# EAGLE design lyme_shield_system_gen2 (EAGLE 9.6.2)
APPROVED: MK; CONTACT: rluttrell@hatchpoint.com; DESIGNED: RSL; FILENAME: lyme_shield_system.sch; REV: 1.1; SCHEMATIC_TITLE: LymeShieldSystem Main Board; SIZE: A1
Assembly variants: A

## Sheet 1 of 3: Title Page and Revisions
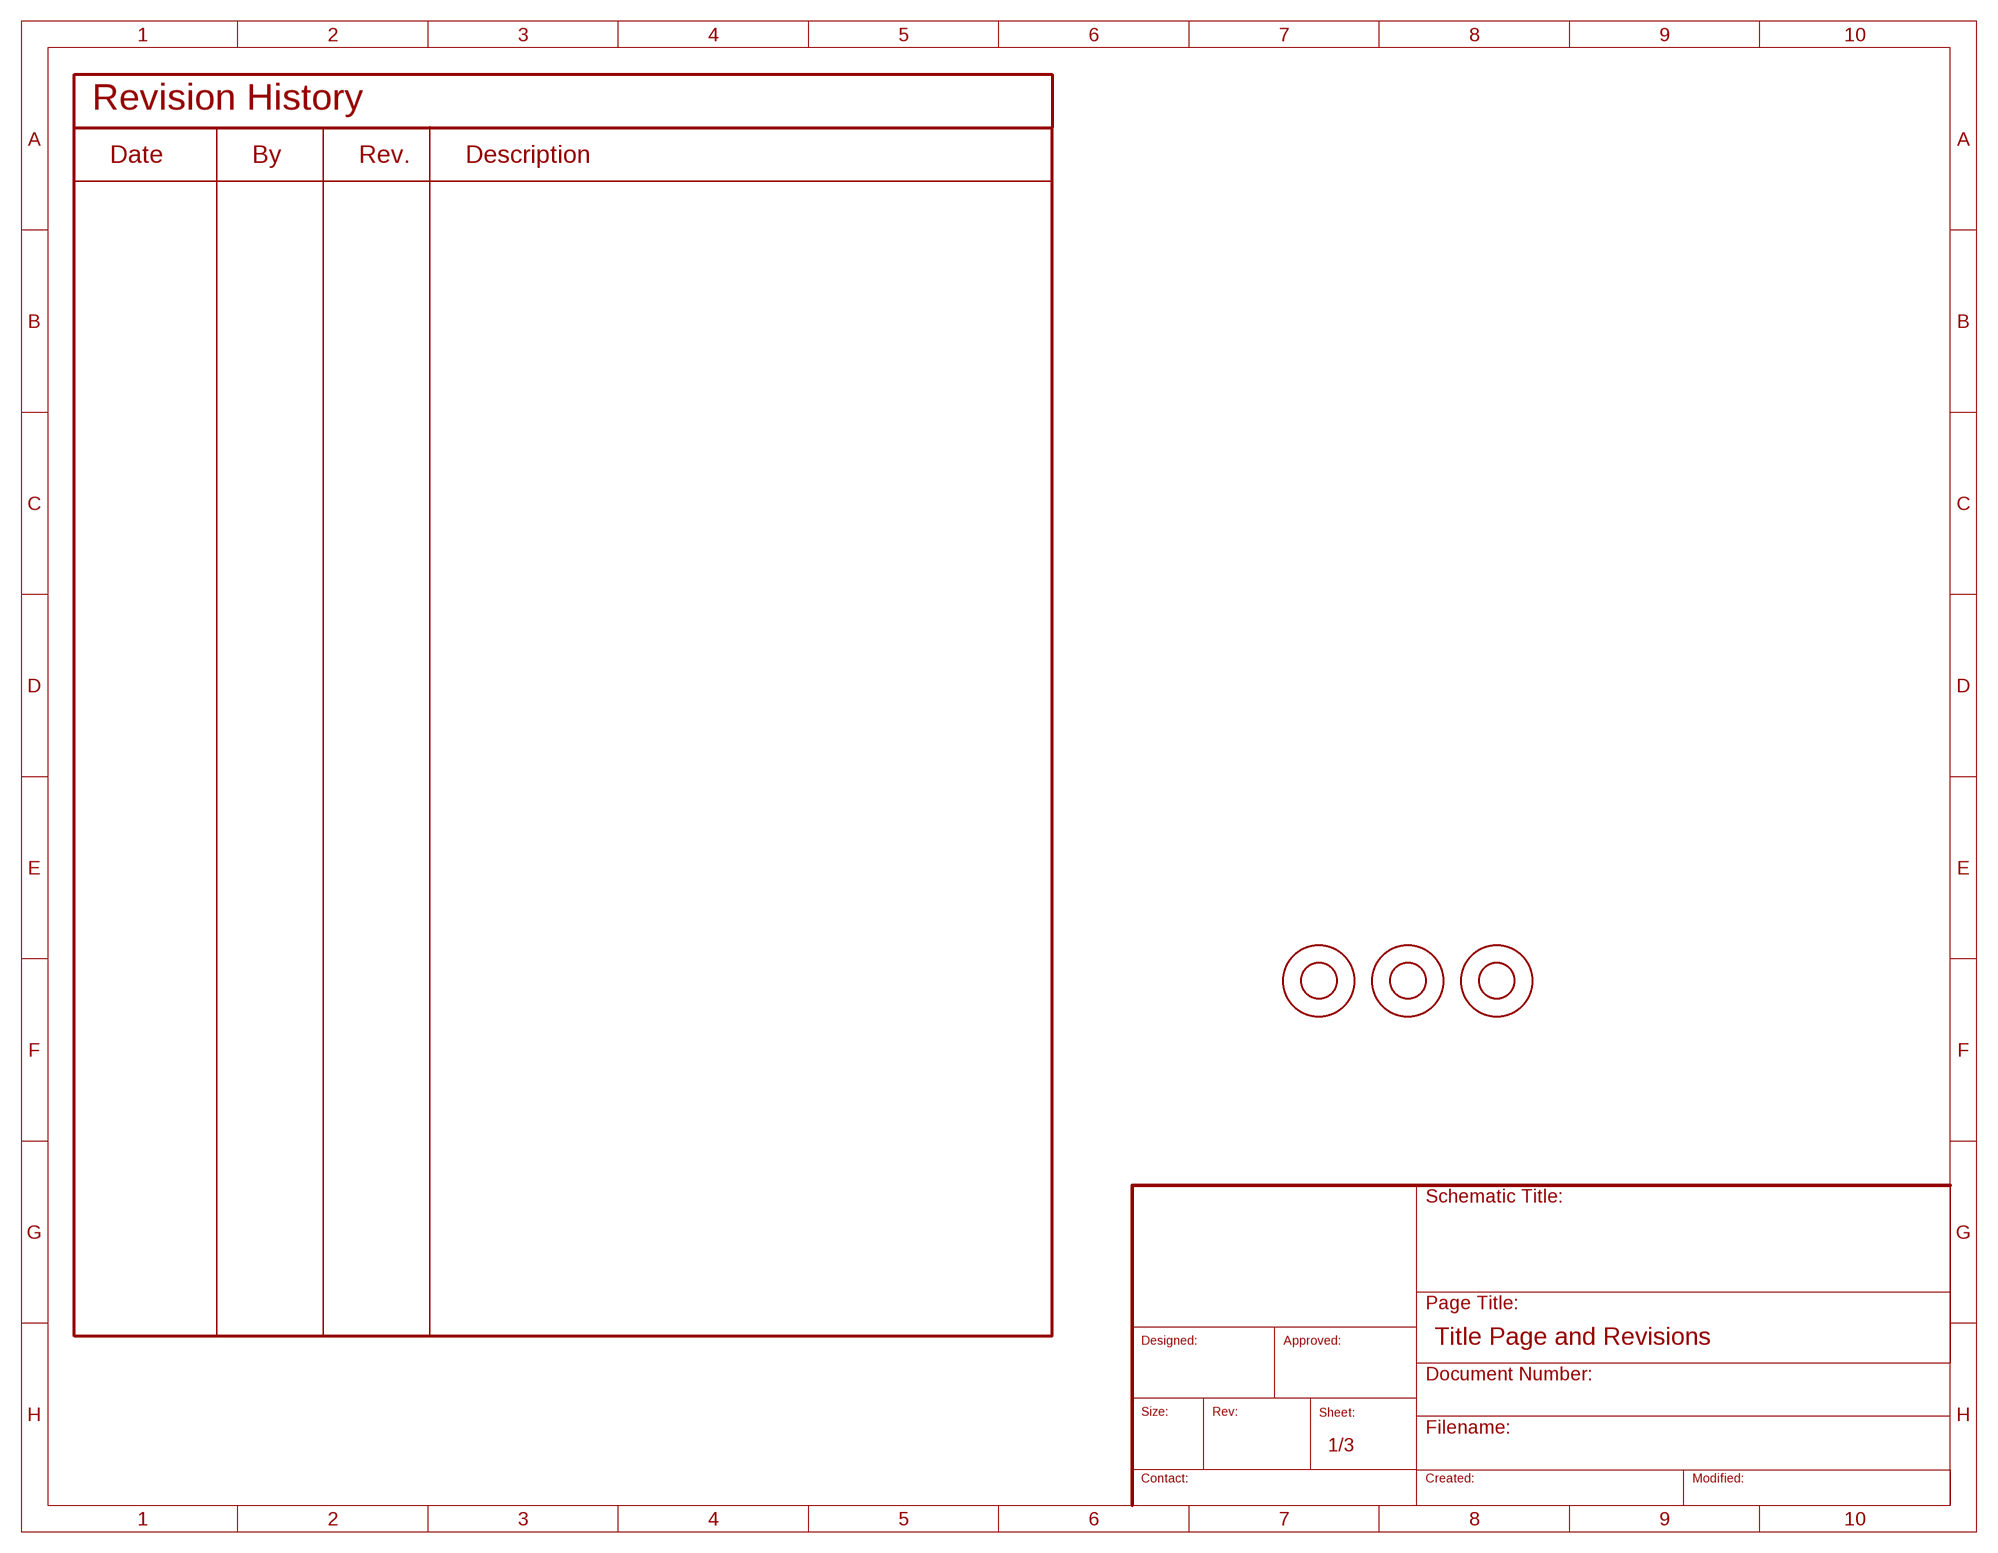
[diagram p0: schematic, sheet 1]

### Parts
FID1  FIDUCIAL_1MM_TOP_BOTTOM  [FIDUCIAL_1MM_TOP_BOTTOM]  (not fitted in variant A)
FID2  FIDUCIAL_1MM_TOP_BOTTOM  [FIDUCIAL_1MM_TOP_BOTTOM]  (not fitted in variant A)
FID3  FIDUCIAL_1MM_TOP_BOTTOM  [FIDUCIAL_1MM_TOP_BOTTOM]  (not fitted in variant A)

## Sheet 2 of 3: Microcontroller and Peripherals
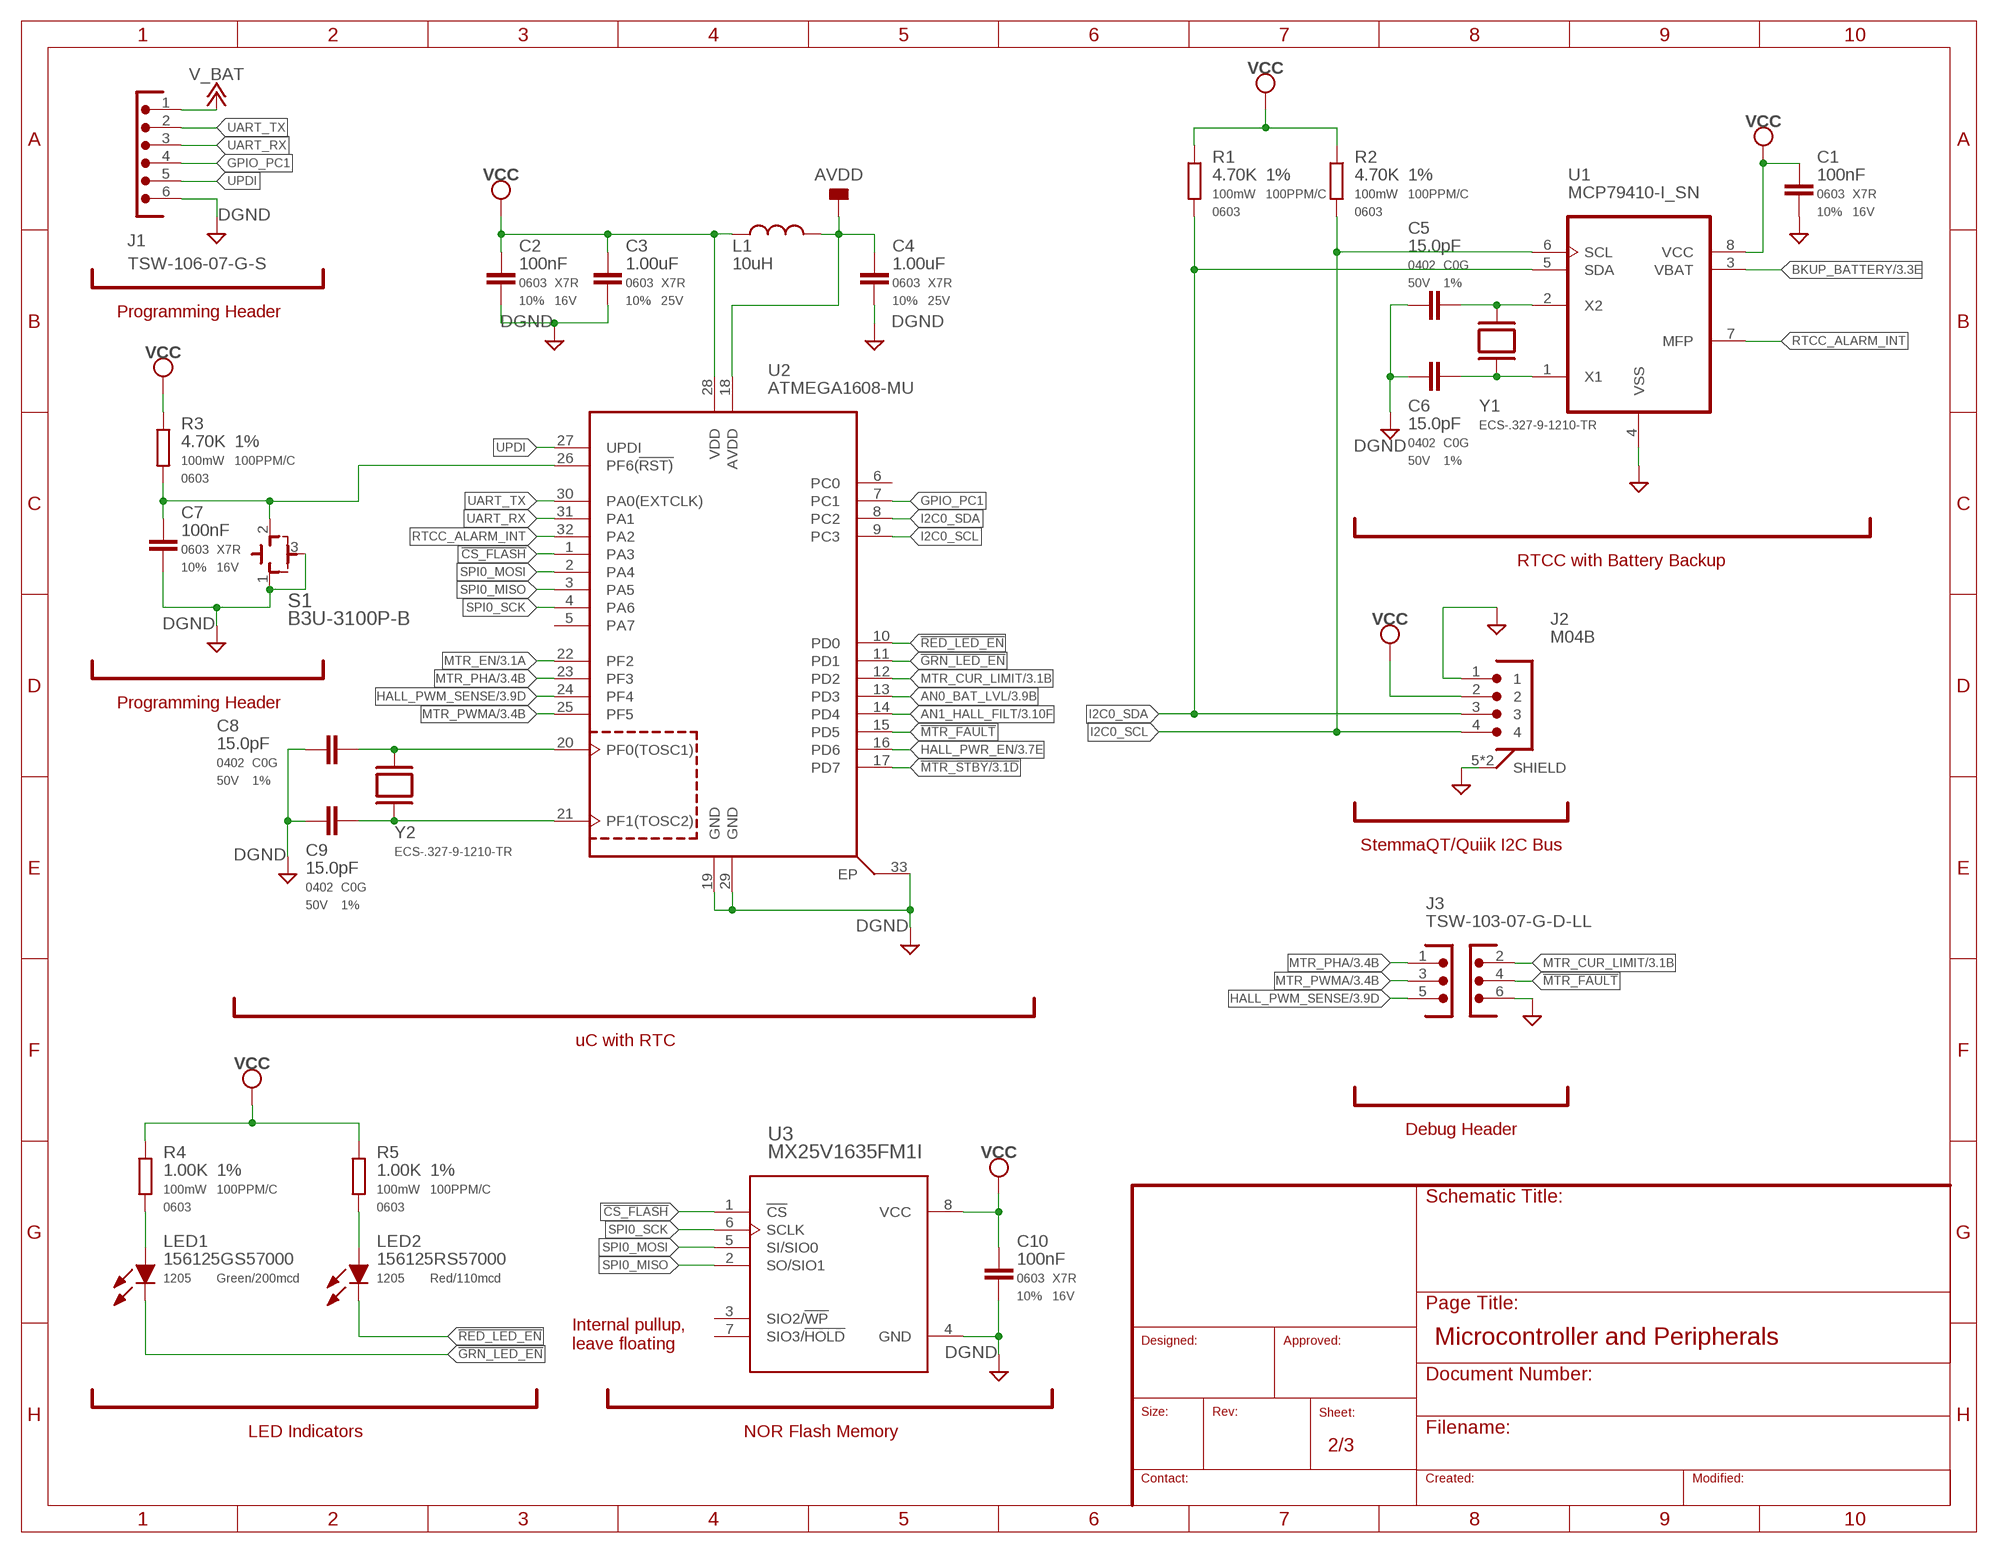
[diagram p1: schematic, sheet 2]

### Parts
C1  100nF  GCM188R71C104KA37J  [CAPC_0603_1608X90N]  (not fitted in variant A)
C2  100nF  GCM188R71C104KA37J  [CAPC_0603_1608X90N]
C3  1.00uF  GCM188R71E105KA64D  [CAPC_0603_1608X90N]
C4  1.00uF  GCM188R71E105KA64D  [CAPC_0603_1608X90N]
C5  15.0pF  GCM1555C1H150FA16D  [CAPC_0402_1005X55N]  (not fitted in variant A)
C6  15.0pF  GCM1555C1H150FA16D  [CAPC_0402_1005X55N]  (not fitted in variant A)
C7  100nF  GCM188R71C104KA37J  [CAPC_0603_1608X90N]
C8  15.0pF  GCM1555C1H150FA16D  [CAPC_0402_1005X55N]
C9  15.0pF  GCM1555C1H150FA16D  [CAPC_0402_1005X55N]
C10  100nF  GCM188R71C104KA37J  [CAPC_0603_1608X90N]  (not fitted in variant A)
J1  TSW-106-07-G-S  [HDR-100MIL-1X6-THRU]  (not fitted in variant A)
J2  M04B  [SM04B-SRSS-TB(LFSN)]  (not fitted in variant A)
J3  TSW-103-07-G-D-LL  [HDRV6W64P254_2X3_762X495X838P]  (not fitted in variant A)
L1  10uH  LB1608T100M  [INDC1608X90N]
LED1  156125GS57000  [LEDC3212X120N]
LED2  156125RS57000  [LEDC3212X120N]
R1  4.70K  CRCW06034K70FKEA  [R0603K]
R2  4.70K  CRCW06034K70FKEA  [R0603K]
R3  4.70K  CRCW06034K70FKEA  [R0603K]
R4  1.00K  CRCW06031K00FKEAC  [R0603K]
R5  1.00K  CRCW06031K00FKEAC  [R0603K]
S1  B3U-3100P-B  [B3U-3100P-B]
U1  MCP79410-I_SN  [SOIC127P600X175-8N]  (not fitted in variant A)
U2  ATMEGA1608-MU  [QFN50P500X500X90-33N]
U3  MX25V1635FM1I  [SOIC127P600X175-8N]  (not fitted in variant A)
Y1  ECS-.327-9-1210-TR  [XTAL_ECS-.327-9-1210-TR]  (not fitted in variant A)
Y2  ECS-.327-9-1210-TR  [XTAL_ECS-.327-9-1210-TR]

### Nets
!CS_FLASH: U2.1(PA3) U3.1(!CS)
!GRN_LED_EN: LED1.1(K) U2.11(PD1)
!MTR_FAULT: J3.4 U2.15(PD5)
!MTR_STBY: U2.17(PD7) ; also sheet 3
!RED_LED_EN: LED2.1(K) U2.10(PD0)
!RST: C7.1 R3.2 S1.2(NO) U2.26(PF6(!RST))
AN0_BAT_LVL: U2.13(PD3) ; also sheet 3
AN1_HALL_FILT: U2.14(PD4) ; also sheet 3
AVDD: C4.1 L1.2 U2.18(AVDD)
BKUP_BATTERY: U1.3(VBAT) ; also sheet 3
DGND [pwr]: C1.2 C2.2 C3.2 C4.2 C5.2 C6.2 C7.2 C8.2 C9.2 C10.2 J1.6 J2.1 J2.5(SHIELD) J2.6(SHIELD) J3.6 S1.1(COM) S1.3(COM1) U1.4(VSS) U2.19(GND) U2.29(GND) U2.33(EP) U3.4(GND) ; also sheet 3
GPIO_PC1: J1.4 U2.7(PC1)
HALL_PWM_SENSE: J3.5 U2.24(PF4) ; also sheet 3
HALL_PWR_EN: U2.16(PD6) ; also sheet 3
I2C0_SCL: J2.4 R2.2 U1.6(SCL) U2.9(PC3)
I2C0_SDA: J2.3 R1.2 U1.5(SDA) U2.8(PC2)
MTR_CUR_LIMIT: J3.2 U2.12(PD2) ; also sheet 3
MTR_EN: U2.22(PF2) ; also sheet 3
MTR_PHA: J3.1 U2.23(PF3) ; also sheet 3
MTR_PWMA: J3.3 U2.25(PF5) ; also sheet 3
N$1: C8.1 U2.20(PF0(TOSC1)) Y2.1
N$2: C5.1 U1.2(X2) Y1.1
N$8: LED1.2(A) R4.2
N$9: LED2.2(A) R5.2
N$16: C9.1 U2.21(PF1(TOSC2)) Y2.2
N$17: C6.1 U1.1(X1) Y1.2
RTCC_ALARM_INT: U1.7(MFP) U2.32(PA2)
SPI0_MISO: U2.3(PA5) U3.2(SO/SIO1)
SPI0_MOSI: U2.2(PA4) U3.5(SI/SIO0)
SPI0_SCK: U2.4(PA6) U3.6(SCLK)
UART_RX: J1.3 U2.31(PA1)
UART_TX: J1.2 U2.30(PA0(EXTCLK))
UPDI: J1.5 U2.27(UPDI)
V_BAT [high_current]: J1.1 ; also sheet 3
VCC [pwr]: C1.1 C2.1 C3.1 C10.1 J2.2 L1.1 R1.1 R2.1 R3.1 R4.1 R5.1 U1.8(VCC) U2.28(VDD) U3.8(VCC) ; also sheet 3
Unconnected: U2.5(PA7) U2.6(PC0) U3.3(SIO2/!WP) U3.7(SIO3/!HOLD)

### Notes on the sheet
- Programming Header
- RTCC with Battery Backup
- Programming Header
- StemmaQT/Quiik I2C Bus
- uC with RTC
- Debug Header
- Internal pullup, 
  leave floating
- LED Indicators | NOR Flash Memory

## Sheet 3 of 3: Motor Driver and Position Sensor
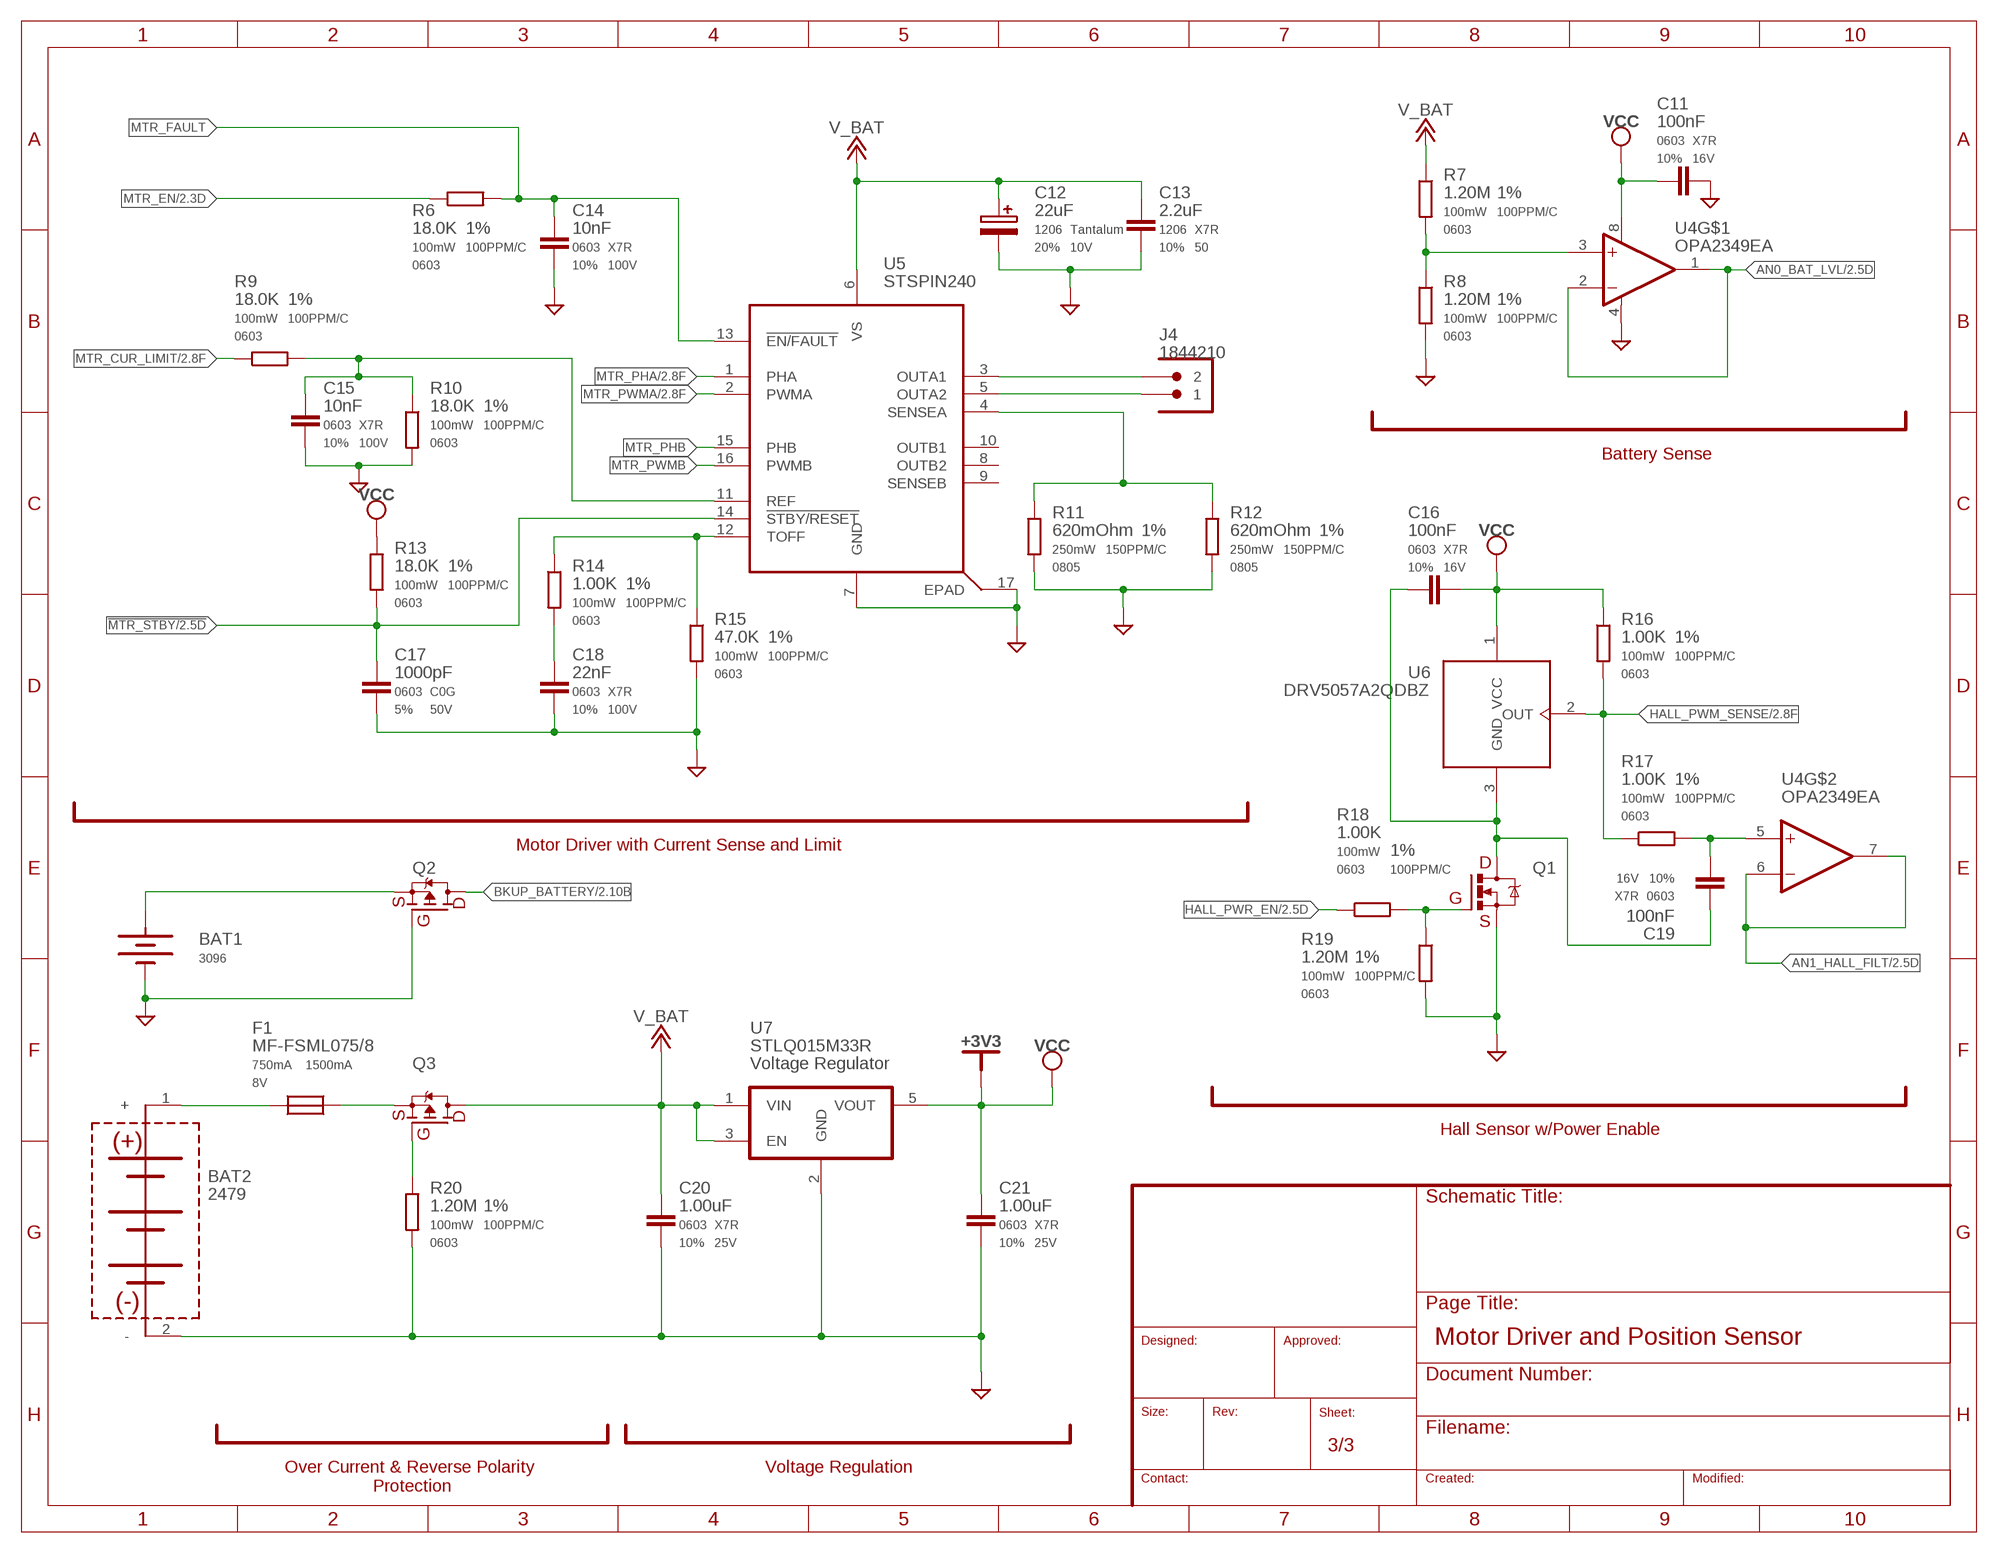
[diagram p2: schematic, sheet 3]

### Parts
BAT1  3096  [3096]  (not fitted in variant A)
BAT2  2479  [2479]
C11  100nF  GCM188R71C104KA37J  [CAPC_0603_1608X90N]
C12  22uF  TAJC226M010RNJ  [CAPC_1206]
C13  2.2uF  GCM31CR71H225KA55L  [CAPC_1206]
C14  10nF  GCM188R72A103KA37D  [CAPC_0603_1608X90N]
C15  10nF  GCM188R72A103KA37D  [CAPC_0603_1608X90N]
C16  100nF  GCM188R71C104KA37J  [CAPC_0603_1608X90N]
C17  1000pF  GCM1885C1H102JA16J  [CAPC_0603_1608X90N]
C18  22nF  GCM188R72A223KA37D  [CAPC_0603_1608X90N]
C19  100nF  GCM188R71C104KA37J  [CAPC_0603_1608X90N]
C20  1.00uF  GCM188R71E105KA64D  [CAPC_0603_1608X90N]
C21  1.00uF  GCM188R71E105KA64D  [CAPC_0603_1608X90N]
F1  MF-FSML075/8  [FUSC1608X70N]
J4  1844210  [1844210-2-3.50]  (not fitted in variant A)
Q1  FDN5632N-F085-FDN5632N_F085  [SOT-23]
Q2  PMOS_DMP2035U-7  [SOT-23]  (not fitted in variant A)
Q3  PMOS_DMP2035U-7  [SOT-23]
R6  18.0K  CRCW060318K0FKEAC  [R0603K]
R7  1.20M  CRCW06031M20FKEA  [R0603K]
R8  1.20M  CRCW06031M20FKEA  [R0603K]
R9  18.0K  CRCW060318K0FKEAC  [R0603K]
R10  18.0K  CRCW060318K0FKEAC  [R0603K]
R11  620mOhm  ERJU6QFR62V  [R0805K]
R12  620mOhm  ERJU6QFR62V  [R0805K]
R13  18.0K  CRCW060318K0FKEAC  [R0603K]
R14  1.00K  CRCW06031K00FKEAC  [R0603K]
R15  47.0K  CRCW060347K0FKEAC  [R0603K]
R16  1.00K  CRCW06031K00FKEAC  [R0603K]
R17  1.00K  CRCW06031K00FKEAC  [R0603K]
R18  1.00K  CRCW06031K00FKEAC  [R0603K]
R19  1.20M  CRCW06031M20FKEA  [R0603K]
R20  1.20M  CRCW06031M20FKEA  [R0603K]
U4  OPA2349EA  [SOT65P280X145-8N]
U5  STSPIN240  [VFQFPN(3X3X1.0MM-16L)]
U6  DRV5057A2QDBZ  [SOT95P237X112-3N]
U7  STLQ015M33R  [SOT23-5L]

### Nets
!MTR_STBY: C17.1 R13.2 U5.14(!STBY/RESET) ; also sheet 2
AN0_BAT_LVL: U4.1(OUT) U4.2(-IN) ; also sheet 2
AN1_HALL_FILT: U4.6(-IN) U4.7(OUT) ; also sheet 2
BKUP_BATTERY: Q2.1(D) ; also sheet 2
DGND [pwr]: BAT1.1(-) BAT1.3(-) BAT2.2(-) C11.1 C12.2(-) C13.2 C14.2 C15.2 C17.2 C18.2 C20.2 C21.2 Q1.2(S) Q2.3(G) R8.2 R10.2 R11.2 R12.2 R15.2 R19.2 R20.2 U4.4(V-) U5.7(GND) U5.17(EPAD) U7.2(GND) ; also sheet 2
HALL_PWM_SENSE: R16.2 R17.1 U6.2(OUT) ; also sheet 2
HALL_PWR_EN: R18.1 ; also sheet 2
MTR_CUR_LIMIT: R9.1 ; also sheet 2
MTR_EN: R6.1 ; also sheet 2
MTR_FAULT: C14.1 R6.2 U5.13(!EN/FAULT)
MTR_PHA: U5.1(PHA) ; also sheet 2
MTR_PHB: U5.15(PHB)
MTR_PWMA: U5.2(PWMA) ; also sheet 2
MTR_PWMB: U5.16(PWMB)
N$3: R14.1 R15.1 U5.12(TOFF)
N$5: Q1.3(G) R18.2 R19.1
N$6: Q3.3(G) R20.1
N$7: BAT1.2(+) Q2.2(S)
N$10: R7.2 R8.1 U4.3(+IN)
N$11: C18.1 R14.2
N$14 [high_current]: F1.2 Q3.2(S)
N$15 [high_current]: BAT2.1(+) F1.1
N$19: C15.1 R9.2 R10.1 U5.11(REF)
N$20: C19.1 R17.2 U4.5(+IN)
N$23 [pwr]: C16.2 C19.2 Q1.1(D) U6.3(GND)
OUTA1 [high_current]: J4.P$2 U5.3(OUTA1)
OUTA2 [high_current]: J4.P$1 U5.5(OUTA2)
SENSEA [high_current]: R11.1 R12.1 U5.4(SENSEA)
V_BAT [high_current]: C12.1(+) C13.1 C20.1 Q3.1(D) R7.1 U5.6(VS) U7.1(VIN) U7.3(EN) ; also sheet 2
VCC [pwr]: C11.2 C16.1 C21.1 R13.1 R16.1 U4.8(V+) U6.1(VCC) U7.5(VOUT) ; supply symbol labelled +3V3 ; also sheet 2
Unconnected: U5.8(OUTB2) U5.9(SENSEB) U5.10(OUTB1)

### Notes on the sheet
- Battery Sense
- Motor Driver with Current Sense and Limit
- Hall Sensor w/Power Enable
- Over Current & Reverse Polarity 
  Protection
- Voltage Regulation

## Library data of the parts
BAT1 = HatchPoint-Batteries:3096: Battery Contacts 2996 matte Tin Coin Cell Retainer Source: Datasheet <http://www.keyelco.com/product-pdf.cfm?p=768>; DESCRIPTION: Battery Contacts 2996 matte Tin Coin Cell Retainer; HEIGHT: 5.97mm; MANUFACTURER_NAME: Keystone Electronics; MANUFACTURER_PART_NUMBER: 3096; MOUSER_PART_NUMBER: 534-3096; MOUSER_PRICE-STOCK: https://www.mouser.co.uk/ProductDetail/Keystone-Electronics/3096?qs=BMR1h6ig6pBmf86jRreoMg%3D%3D
BAT2 = HatchPoint-Batteries:2479: KEYSTONE - 2479 - BATTERY HOLDER, AAA, 3WAY Source: Datasheet <http://www.keyelco.com/product-pdf.cfm?p=1041>; DESCRIPTION: KEYSTONE - 2479 - BATTERY HOLDER, AAA, 3WAY; HEIGHT: 13mm; MANUFACTURER_NAME: Keystone Electronics; MANUFACTURER_PART_NUMBER: 2479; MOUSER_PART_NUMBER: 534-2479; MOUSER_PRICE-STOCK: https://www.mouser.co.uk/ProductDetail/Keystone-Electronics/2479?qs=Q3RoVmURDomBPD85HfXZoA%3D%3D
C1 C2 C7 C10 C11 C16 C19 = HatchPoint-Capacitors:GCM?*: GCM Series Multilayer Ceramic Capacitors MLCC Murata; MANUFACTURER: Murata; PACKAGE: 0603; TOL: 10%; TYPE: X7R; VDC: 16V
C3 C4 C20 C21 = HatchPoint-Capacitors:GCM?*: GCM Series Multilayer Ceramic Capacitors MLCC Murata; MANUFACTURER: Murata; PACKAGE: 0603; TOL: 10%; TYPE: X7R; VDC: 25V
C5 C6 C8 C9 = HatchPoint-Capacitors:GCM?*: GCM Series Multilayer Ceramic Capacitors MLCC Murata; MANUFACTURER: Murata; PACKAGE: 0402; TOL: 1%; TYPE: C0G; VDC: 50V
C12 = HatchPoint-Capacitors:TAJ?*; DESCRIPTION: Tantalum Capcitor, 3Ohm ESR; ESR: 3.0; MANUFACTURER: AVX; PACKAGE: 1206; TOL: 20%; TYPE: Tantalum; VDC: 10V
C13 = HatchPoint-Capacitors:GCM?*: GCM Series Multilayer Ceramic Capacitors MLCC Murata; DESCRIPTION: Murata 1206 Ceramic Capacitor; MANUFACTURER: Murata; PACKAGE: 1206; TOL: 10%; TYPE: X7R; VDC: 50
C14 C15 C18 = HatchPoint-Capacitors:GCM?*: GCM Series Multilayer Ceramic Capacitors MLCC Murata; MANUFACTURER: Murata; PACKAGE: 0603; TOL: 10%; TYPE: X7R; VDC: 100V
C17 = HatchPoint-Capacitors:GCM?*: GCM Series Multilayer Ceramic Capacitors MLCC Murata; MANUFACTURER: Murata; PACKAGE: 0603; TOL: 5%; TYPE: C0G; VDC: 50V
F1 = HatchPoint-Bourns:MF-FSML?: Resettable Fuses - PPTC 8V 1.25A Source: Datasheet <https://www.mouser.com/datasheet/2/54/bourns_05032019_MF-FSML-X_datasheet-1591429.pdf>; DESCRIPTION: Poly Fuse; IHOLD: 750mA; ITRIP: 1500mA; VMAX: 8V
FID1-FID3 = HatchPoint:FIDUCIAL
J1 = HatchPoint-Samtec:TSW-106-07-G-S
J2 = HatchPoint-JST:?M04B*: 4 way side entry SMT header,1mm pitch JST SH Series, 1mm Pitch 4 Way 1 Row Right Angle PCB Header, Solder Termination, 1A Source: Datasheet <http://docs-emea.rs-online.com/webdocs/05b0/0900766b805b098a.pdf>; DESCRIPTION: 4 way side entry SMT header,1mm pitch JST SH Series, 1mm Pitch 4 Way 1 Row Right Angle PCB Header, Solder Termination, 1A; HEIGHT: mm; MANUFACTURER_NAME: JST (JAPAN SOLDERLESS TERMINALS); MANUFACTURER_PART_NUMBER: SM04B-SRSS-TB(LFSN)
J3 = HatchPoint-Samtec:TSW-103-07-G-D-LL: CONN HEADER 6 POS .100" Source: Datasheet <http://suddendocs.samtec.com/catalog_english/tsw_th.pdf>; ARROW_PART_NUMBER: TSW-103-07-G-D-LL; ARROW_PRICE-STOCK: https://www.arrow.com/en/products/tsw-103-07-g-d-ll/samtec?region=nac; DESCRIPTION: CONN HEADER 6 POS .100"; HEIGHT: 8.38mm; MANUFACTURER_NAME: SAMTEC; MANUFACTURER_PART_NUMBER: TSW-103-07-G-D-LL; MOUSER_PART_NUMBER: 200-TSW10307GDLL; MOUSER_PRICE-STOCK: https://www.mouser.co.uk/ProductDetail/Samtec/TSW-103-07-G-D-LL?qs=rU5fayqh%252BE3VkDqz1GA%2F6A%3D%3D
J4 = HatchPoint-PhoenixContact:1844210
L1 = HatchPoint-Inductors:LB1608T100M: Ind Chip Wirewound 10uH 20% 2.52MHz Ferrite 60mA 0603 T/R Check prices <https://pricing.snapeda.com/parts/LB1608T100M/Taiyo%20Yuden/view-part?ref=eda>; AVAILABILITY: Good; DESCRIPTION: 10µH Unshielded Wirewound Inductor 60mA 700mOhm 0603 (1608 Metric); IDC: 60mA; MF: Taiyo Yuden; MP: LB1608T100M; PACKAGE: 0603; R: 700mOhm
LED1 = HatchPoint-Wurtz:156125: 3.9 V Green LED 1205 SMD, Wurth Elektronik WL-SMRD 156125GS57000 Source: Datasheet <https://docs.rs-online.com/0ef6/0900766b816634b7.pdf>; DESCRIPTION: Green/200mcd; MANUFACTURER_NAME: Wurth Electronics; PACKAGE: 1205
LED2 = HatchPoint-Wurtz:156125: 3.9 V Green LED 1205 SMD, Wurth Elektronik WL-SMRD 156125GS57000 Source: Datasheet <https://docs.rs-online.com/0ef6/0900766b816634b7.pdf>; DESCRIPTION: Red/110mcd; MANUFACTURER_NAME: Wurth Electronics; PACKAGE: 1205
Q1 = HatchPoint-Transistors:FDN5632N-F085: MOSFET Trans MOS N-Ch 60V 1.7A; DESCRIPTION: On Semi N-MOS 60V 1.7A 98mOhm MOSFET; MANUFACTURER: ON Semiconductor
Q2 Q3 = HatchPoint-Transistors:PMOS: MOSFET MOSFET P-CHANNEL SOT-23; MF: Diodes Incorporated; MP: DMP2035U-7; POPULATE: Y
R1-R10 R13-R20 = HatchPoint-Resistors:CRCW?*: Vishay/Dale SMD Resistor; MF: Vishay; PACKAGE: 0603; PWR_RATE: 100mW; TEMPCO: 100PPM/C; TOLERANCE: 1%; TYPE: Thick Film
R11 R12 = HatchPoint-Resistors:ERJ?*; MANUFACTURER: Panasonic; PACKAGE: 0805; PWR_RATE: 250mW; TEMPCO: 150PPM/C; TOLERANCE: 1%
S1 = HatchPoint-OMRON:B3U-3100*
U1 = HatchPoint-MicrochipTechnology:MCP79410-I_SN: I2C GP RTCC, 1Kb EE, 64B SRAM, ID Source: Datasheet <https://datasheet.datasheetarchive.com/originals/distributors/Datasheets-DGA3/278325.pdf>; ARROW_PART_NUMBER: MCP79410-I/SN; ARROW_PRICE-STOCK: https://www.arrow.com/en/products/mcp79410-isn/microchip-technology; DESCRIPTION: I2C GP RTCC, 1Kb EE, 64B SRAM, ID; HEIGHT: 1.75mm; MANUFACTURER_NAME: Microchip; MANUFACTURER_PART_NUMBER: MCP79410-I/SN; MOUSER_PART_NUMBER: 579-MCP79410-I/SN; MOUSER_PRICE-STOCK: https://www.mouser.co.uk/ProductDetail/Microchip-Technology/MCP79410-I-SN?qs=LU7oW20kJpNhp%252BQbxumdTQ%3D%3D
U2 = HatchPoint-MicrochipTechnology:ATMEGA1608: 8-bit Microcontrollers - MCU 20MHz, 16KB, SOIC Source: Datasheet <http://www.microchip.com/mymicrochip/filehandler.aspx?ddocname=en604845>; DESCRIPTION: 8-bit Microcontrollers - MCU 20MHz, 16KB, SOIC; HEIGHT: 0.9mm; MANUFACTURER_NAME: Microchip; MANUFACTURER_PART_NUMBER: ATMEGA1608-MU; MOUSER_PART_NUMBER: 556-ATMEGA1608-MU; MOUSER_PRICE-STOCK: https://www.mouser.co.uk/ProductDetail/Microchip-Technology-Atmel/ATMEGA1608-MU?qs=P1JMDcb91o6TsqFiAm0Zmw%3D%3D
U3 = HatchPoint-Macronix:MX25V*?; DENSITY: 16Mb; DESCRIPTION: Macronix 16Mb (2Mx8) NOR Flash 8-SOIC; MANUFACTURER: Macronix
U4 = HatchPoint-OPAMPs:OPA2349: 1uA, Rail-to-Rail, CMOS Operational Amplifiers Source: Datasheet <http://www.ti.com/lit/gpn/OPA2349>; ARROW_PART_NUMBER: OPA2349EA/3K; ARROW_PRICE-STOCK: https://www.arrow.com/en/products/opa2349ea3k/texas-instruments?region=nac; DESCRIPTION: 1uA, Rail-to-Rail, CMOS Operational Amplifiers; HEIGHT: 1.45mm; MANUFACTURER_NAME: Texas Instruments; MANUFACTURER_PART_NUMBER: OPA2349EA/3K; MOUSER_PART_NUMBER: 595-OPA2349EA/3K; MOUSER_PRICE-STOCK: https://www.mouser.co.uk/ProductDetail/Texas-Instruments/OPA2349EA-3K?qs=7nS3%252BbEUL6sMpP9ngN4Iww%3D%3D
U5 = HatchPoint-TI:STSPIN240: Motor / Motion / Ignition Controllers & Drivers Low voltage dual brush DC motor driver Source: Datasheet <http://www.st.com/content/ccc/resource/technical/document/datasheet/group3/2f/ef/09/12/89/cd/41/c8/DM00293532/files/DM00293532.pdf/jcr:content/translations/en.DM00293532.pdf>; ARROW_PART_NUMBER: STSPIN240; ARROW_PRICE-STOCK: https://www.arrow.com/en/products/stspin240/stmicroelectronics?region=nac; DESCRIPTION: Motor / Motion / Ignition Controllers & Drivers Low voltage dual brush DC motor driver; HEIGHT: mm; MANUFACTURER_NAME: STMicroelectronics; MANUFACTURER_PART_NUMBER: STSPIN240; MOUSER_PART_NUMBER: 511-STSPIN240; MOUSER_PRICE-STOCK: https://www.mouser.co.uk/ProductDetail/STMicroelectronics/STSPIN240?qs=%2FnKYMpMO73P14mEILm2sPg%3D%3D
U6 = HatchPoint-TI:DRV5057: High voltage (up to 38V), linear hall effect sensor Source: Datasheet <https://www.ti.com/lit/gpn/DRV5053>
U7 = HatchPoint-ST:STLQ015M: LDO Voltage Regulators 150 mA - ultra low quiescent current linear voltage regulator; DESC: Voltage Regulator; MF: STM; MP: STLQ015M33R; VOLTAGE: 3.3V
Y1 Y2 = HatchPoint-ABRACON:ECS-.327-9-1210-TR: Crystal 2-SMD, No Lead; CL: 9.0pF; DESCRIPTION: 32.768kHz ±20ppm Crystal 9pF 90 kOhms 2-SMD, No Lead; DIGI-KEY_PART_NUMBER: XC2283CT-ND; MF: ECS Inc.; MP: ECS-.327-9-1210-TR; PACKAGE: SMD-2 ECS International; PURCHASE-URL: https://pricing.snapeda.com/search/part/ECS-.327-9-1210-TR/?ref=eda; TOL: 20ppm

## Net classes
0 default: width 0.203 mm, drill 0.356 mm, clearance 0.152 mm
1 pwr: width 0.305 mm, drill 0.356 mm, clearance 0.152 mm to class 0, clearance 0.152 mm
2 high_current: width 0.635 mm, drill 0.356 mm, clearance 0.152 mm to class 0, clearance 0.152 mm to class 1, clearance 0.152 mm

## Board
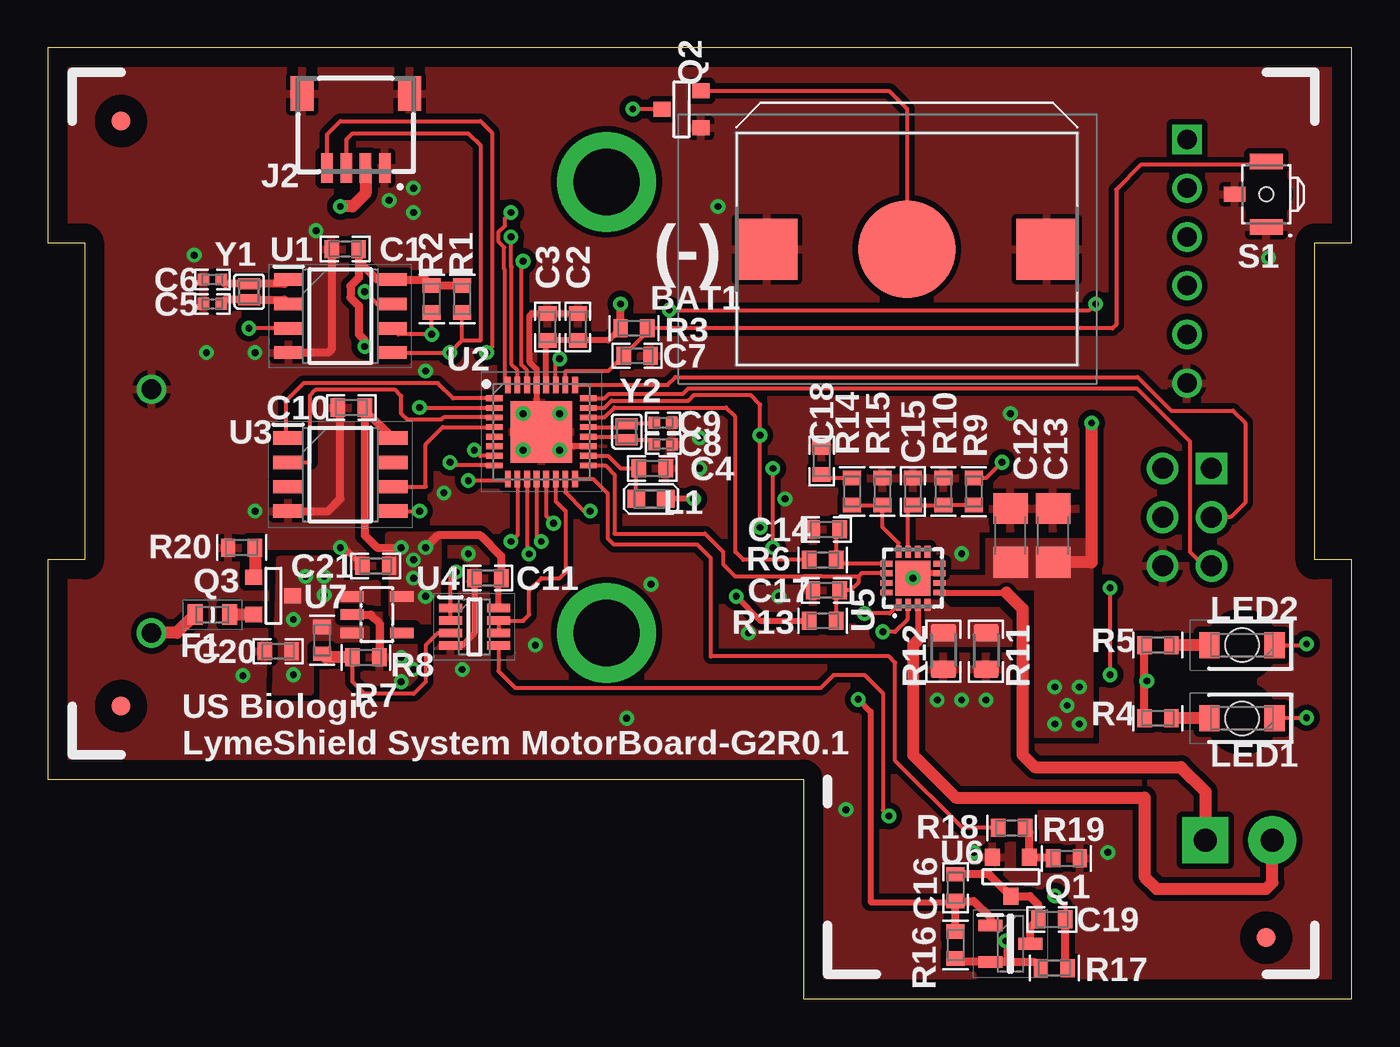
[diagram p3: board, top side]
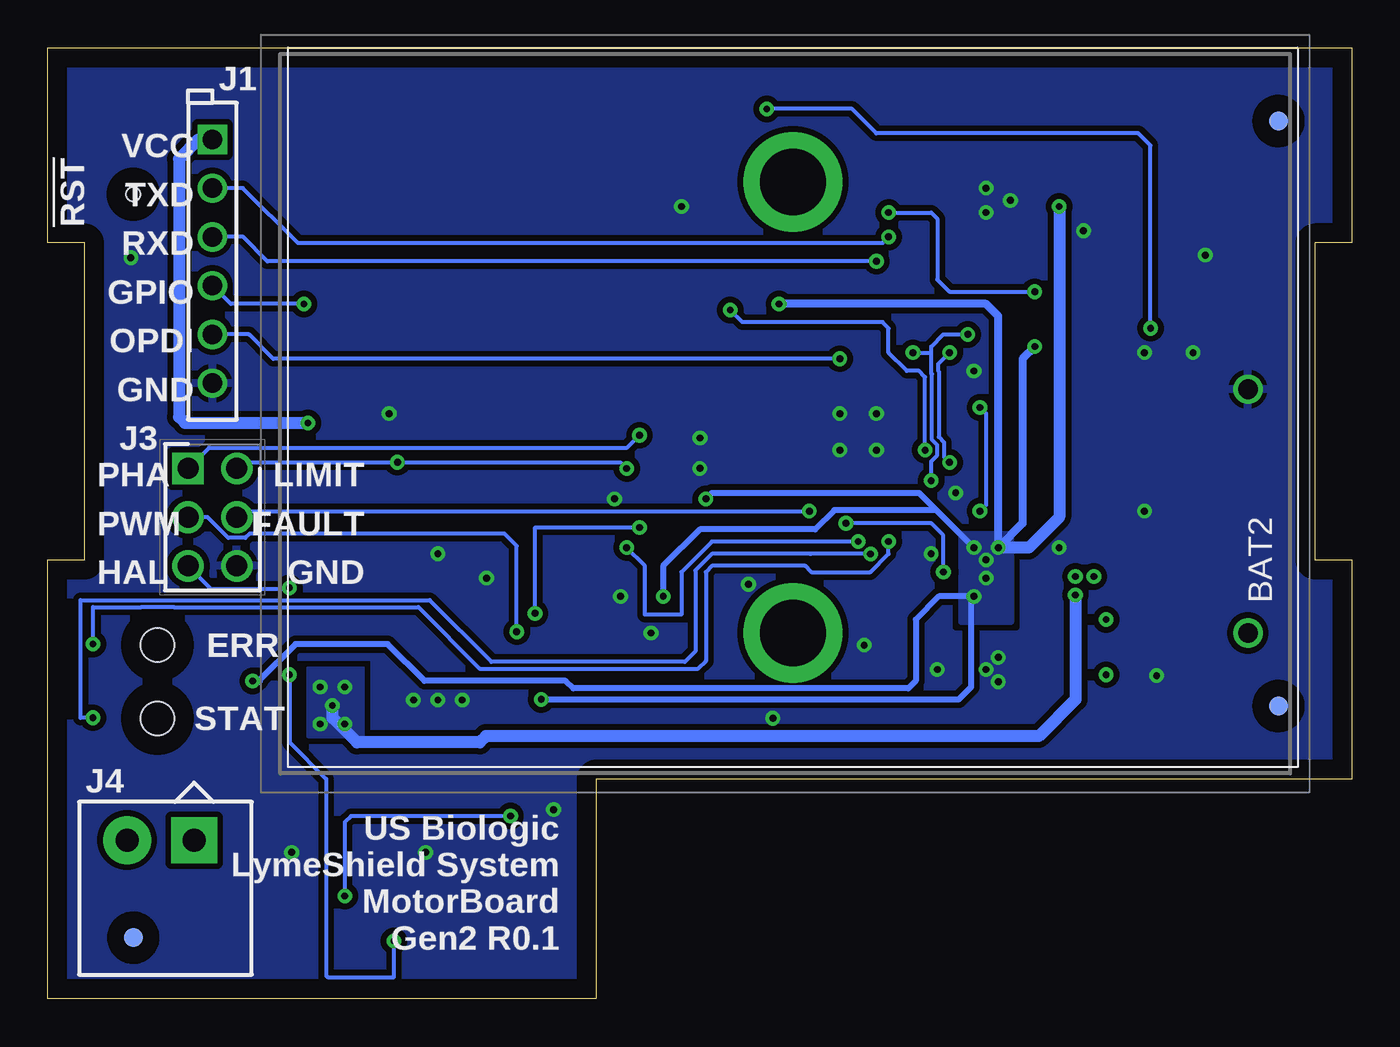
[diagram p4: board, bottom side, seen from below]

Size 67.94 x 49.53 mm. Coordinates in mm from the lower left corner, seen from the top.
Outline: 0,11.43 39.37,11.43 39.37,0 67.94,0 67.94,22.86 66.04,22.86 66.04,39.37 67.94,39.37 67.94,49.53 0,49.53 0,39.37 1.91,39.37 1.91,22.86 0,22.86 0,11.43
Copper layers (1*16): Top 0.035mm / dielectric 1.5mm / Bottom 0.035mm
Design rules "default": minimum track width 6mil, minimum drill 0.35mm, track to track 6mil, track to pad 6mil, pad to pad 6mil, via to via 6mil, smd to smd 6mil, copper to edge 40mil, drill to drill 6mil, minimum pad ring 10mil, minimum via ring 8mil, stop-mask expansion 4mil, vias tented up to drill 0mil, thermal gap 10mil

### Footprints (pad centres in the part's own frame; a part is rotated, then mirrored left to right if it is on the bottom)
3096 = smd 3.18 x 3.18: 1 -7.3,0; 3 7.3,0 | smd 5.08 x 5.08: 2 0,0
2479 = drill 1.02 pad 1.53: 1 0,0; 2 0,-12.7 | drill 3.45 pad 5.175: 3 23.72,0; 4 23.72,-23.5
CAPC_0603_1608X90N = smd 0.75 x 0.94: 1 0,0; 2 1.4,0
CAPC_0402_1005X55N = smd 0.6 x 0.62: 1 -0.46,0; 2 0.46,0
CAPC_1206 = smd 1.6 x 1.8: 1 -1.4,0; 2 1.4,0
FUSC1608X70N = smd 0.77 x 1.07: 1 -0.9,0; 2 0.9,0
FIDUCIAL_1MM_TOP_BOTTOM = smd 1 x 1: 1 0,0 | smd 1 x 1 bottom: 2 0,0
HDR-100MIL-1X6-THRU = drill 1.016 square: 1 0,0 | drill 1.016: 2 5.08,0; 3 2.54,0; 4 7.62,0; 5 10.16,0; 6 12.7,0
SM04B-SRSS-TB(LFSN) = smd 0.6 x 1.55: 1 1.5,4.661; 2 2.5,4.661; 3 3.5,4.661; 4 4.5,4.661 | smd 1.2 x 1.8: 5 0.2,0.786; 6 5.8,0.786
HDRV6W64P254_2X3_762X495X838P = drill 1.1 pad 1.65 square: 1 0,0 | drill 1.1 pad 1.65: 2 0,2.54; 3 2.54,0; 4 2.54,2.54; 5 5.08,0; 6 5.08,2.54
1844210-2-3.50 = drill 1.2 pad 2.4 square: P$1 0,0 | drill 1.2 pad 2.5: P$2 3.5,0
INDC1608X90N = smd 0.89 x 0.93: 1 -0.77,0; 2 0.77,0
LEDC3212X120N = smd 1.05 x 1.35: 1 -1.7,0; 2 1.7,0 | hole 1.753: 0,0
SOT-23 = smd 0.787 x 0.889: 1 0.025,-1.016; 2 -0.94,1.016; 3 0.991,1.016
R0603K = smd 0.75 x 0.94: 1 0,0; 2 1.4,0
R0805K = smd 0.9 x 1.3: 1 0,0; 2 1.9,0
B3U-3100P-B = smd 0.8 x 1.7: 1 1.7,0; 2 -1.7,0 | smd 0.8 x 1.1: 3 0,-1.65 | hole 0.75: 0,0
SOIC127P600X175-8N = smd 1.5 x 0.65: 1 -2.7,1.905; 2 -2.7,0.635; 3 -2.7,-0.635; 4 -2.7,-1.905; 5 2.7,-1.905; 6 2.7,-0.635; 7 2.7,0.635; 8 2.7,1.905
QFN50P500X500X90-33N = smd 0.85 x 0.3: 1 -2.45,1.75; 2 -2.45,1.25; 3 -2.45,0.75; 4 -2.45,0.25; 5 -2.45,-0.25; 6 -2.45,-0.75; 7 -2.45,-1.25; 8 -2.45,-1.75; 17 2.45,-1.75; 18 2.45,-1.25; 19 2.45,-0.75; 20 2.45,-0.25; 21 2.45,0.25; 22 2.45,0.75; 23 2.45,1.25; 24 2.45,1.75 | smd 0.3 x 0.85: 9 -1.75,-2.45; 10 -1.25,-2.45; 11 -0.75,-2.45; 12 -0.25,-2.45; 13 0.25,-2.45; 14 0.75,-2.45; 15 1.25,-2.45; 16 1.75,-2.45; 25 1.75,2.45; 26 1.25,2.45; 27 0.75,2.45; 28 0.25,2.45; 29 -0.25,2.45; 30 -0.75,2.45; 31 -1.25,2.45; 32 -1.75,2.45 | smd 3.2 x 3.2: 33 0,0
SOIC127P600X175-8N' = smd 1.55 x 0.7: 1 -2.725,1.905; 2 -2.725,0.635; 3 -2.725,-0.635; 4 -2.725,-1.905; 5 2.725,-1.905; 6 2.725,-0.635; 7 2.725,0.635; 8 2.725,1.905
SOT65P280X145-8N = smd 1.2 x 0.45: 1 -1.25,0.975; 2 -1.25,0.325; 3 -1.25,-0.325; 4 -1.25,-0.975; 5 1.25,-0.975; 6 1.25,-0.325; 7 1.25,0.325; 8 1.25,0.975
VFQFPN(3X3X1.0MM-16L) = smd 0.63 x 0.3: 1 -1.385,0.75; 2 -1.385,0.25; 3 -1.385,-0.25; 4 -1.385,-0.75; 9 1.385,-0.75; 10 1.385,-0.25; 11 1.385,0.25; 12 1.385,0.75 | smd 0.3 x 0.63: 5 -0.75,-1.385; 6 -0.25,-1.385; 7 0.25,-1.385; 8 0.75,-1.385; 13 0.75,1.385; 14 0.25,1.385; 15 -0.25,1.385; 16 -0.75,1.385 | smd 1.829 x 1.829: 17 0,0
SOT95P237X112-3N = smd 1.25 x 0.6: 1 -1.05,0.95; 2 -1.05,-0.95; 3 1.05,0
SOT23-5L = smd 0.55 x 1.2: 1 -0.95,-1.3; 2 0,-1.3; 3 0.95,-1.3; 4 0.95,1.3; 5 -0.95,1.3
XTAL_ECS-.327-9-1210-TR = smd 0.575 x 1.14: 1 -0.412,0; 2 0.412,0

### Placement (x,y rotation side)
BAT1  44.77,39.05 0 top  (not fitted)
BAT2  5.4,19.05 180 bottom
C1  16.19,39.05 180 top  (not fitted)
C2  27.62,34.29 90 top
C3  26.04,34.29 90 top
C4  30.8,27.62 0 top
C5  8.57,36.2 180 top  (not fitted)
C6  8.57,37.47 180 top  (not fitted)
C7  30,33.5 0 top
C8  32.07,28.89 0 top
C9  32.06,30 0 top
C10  16.51,30.8 180 top  (not fitted)
C11  22.23,21.91 0 top
C12  50.16,24.13 90 top
C13  52.39,24.13 90 top
C14  41.27,24.45 180 top
C15  45.09,25.72 90 top
C16  47.31,5.08 90 top
C17  41.27,21.27 180 top
C18  40.32,27.3 90 top
C19  53.02,4.13 180 top
C20  12.7,18.1 180 top
C21  17.78,22.54 180 top
F1  8.57,20 0 top
FID1  3.81,45.72 0 top  (not fitted)
FID2  3.81,15.24 0 top  (not fitted)
FID3  63.5,3.17 0 top  (not fitted)
J1  59.37,44.77 270 bottom  (not fitted)
J2  19.05,47.94 180 top  (not fitted)
J3  60.64,27.62 270 bottom  (not fitted)
J4  60.33,8.25 180 bottom  (not fitted)
L1  31.43,26.04 180 top
LED1  62.23,14.61 180 top
LED2  62.23,18.41 180 top
Q1  50.16,6.35 0 top
Q2  33.02,46.35 270 top  (not fitted)
Q3  11.75,20.95 90 top
R1  21.59,37.15 270 top
R2  20,37.15 270 top
R3  29.84,34.92 0 top
R4  57.15,14.61 0 top
R5  57.15,18.41 0 top
R6  39.69,22.86 0 top
R7  14.29,19.37 270 top
R8  15.88,17.78 0 top
R9  48.26,27.11 270 top
R10  46.67,25.72 90 top
R11  48.9,19.05 270 top
R12  46.67,19.05 270 top
R13  39.69,19.69 0 top
R14  41.91,25.72 90 top
R15  43.5,25.72 90 top
R16  47.31,3.49 270 top
R17  51.75,1.59 0 top
R18  49.53,8.89 0 top
R19  52.39,7.3 0 top
R20  10.79,23.49 180 top
S1  63.5,41.91 270 top
U1  15.24,35.56 0 top  (not fitted)
U2  25.72,29.53 0 top
U3  MX25V1635FM1I  [SOIC127P600X175-8N']  15.24,27.3 0 top  (not fitted)
U4  22.23,19.37 0 top
U5  45.09,21.91 90 top
U6  50.16,2.86 0 top
U7  17.14,20 270 top
Y1  10.48,36.83 90 top  (not fitted)
Y2  30.16,29.53 90 top

### Tracks (layer width: path | path; a pad name or v marks a point on that pad's centre or on a via)
!CS_FLASH
  Top 0.203: U2.1 21.11,31.28 20.32,32.07 13.34,32.07 12.38,31.11 12.38,29.34 U3.1
!GRN_LED_EN  (via drill 0.36)
  Top 0.203: U2.11 24.97,23.29 25.08,23.18 v25.07,23.17 | LED1.1 63.95,14.63 v65.6,14.63
  Bottom 0.203: v65.6,14.63 66.24,14.63 66.24,20.77 48.05,20.77 44.83,17.55 34.75,17.55 34.2,18.1 34.2,22.32 33.34,23.18 28.21,23.18 28.2,23.17 v25.07,23.17
!MTR_FAULT  (via drill 0.36)
  Top 0.203: U2.15 26.97,26.37 27.94,25.4 v28.26,25.4
  Bottom 0.203: v28.26,25.4 57.78,25.4 J3.4
!MTR_STBY
  Top 0.203: U2.17 29.05,27.78 29.53,27.3 29.53,24.23 34.23,24.23 35.19,23.27 35.19,22.63 35.83,21.99 39.39,21.99 39.4,22 40.35,22 40.36,21.99 42.23,21.99 | R13.2 41.09,21.09 C17.1 41.84,21.27 42.23,21.67 42.23,21.99 | U5.14 42.4,22.16 42.23,21.99
!RED_LED_EN  (via drill 0.36)
  Top 0.203: U2.10 24.47,24.15 v24.13,23.81 | LED2.1 65.54,18.41 v65.6,18.47
  Bottom 0.203: v65.6,18.47 65.6,20.39 63.07,20.39 63.06,20.41 61.4,20.41 61.39,20.39 48.64,20.39 45.44,17.19 34.05,17.19 33.66,17.59 33.66,22.23 33.34,22.54 28.47,22.54 28.15,22.23 25.08,22.23 24.13,23.18 v24.13,23.81
!RST
  Top 0.203: U2.26 26.97,32.68 26.99,32.7 29.21,32.7 C7.1 31.25,34.74 R3.2 55.49,34.92 55.68,35.11 55.68,42.15 56.96,43.43 63.32,43.43 S1.2
AN0_BAT_LVL  (via drill 0.36)
  Top 0.203: U4.2 U4.1 20.98,21.93 v21.27,22.23 | U2.13 25.97,25.15 v26.35,24.77
  Bottom 0.203: v26.35,24.77 21.91,24.77 21.27,24.13 v21.27,22.23
AN1_HALL_FILT
  Top 0.203: U4.6 U4.7 24.76,19.69 24.77,19.69 25.08,20 25.08,21.27 25.72,21.91 26.67,21.91 26.99,22.23 26.99,25.4 26.47,25.92 U2.14
AVDD
  Top 0.203: U2.18 29.19,28.28 29.84,27.62 C4.1 30.66,27.49 L1.2
BKUP_BATTERY  (via drill 0.36)
  Top 0.203: U1.3 v10.48,34.92 | v30.48,46.35 31.98,46.35 Q2.1
  Bottom 0.203: v10.48,34.92 10.48,44.45 11.11,45.09 24.77,45.09 26.04,46.35 v30.48,46.35
DGND  (via drill 0.36)
  Top 0.305: U4.4 21.58,18.39 22.23,19.04 C11.1 | C2.2 C3.2 25.21,35.69 25.08,35.56 25.08,33.19 25.47,32.8 U2.29 25.47,29.78 U2.33 | U2.19 26.87,28.78 v26.67,28.57 | U5.7 45.34,22.16 U5.17 | C21.2 15.43,23.49 v15.24,23.49
  Top 0.406: U3.4 14.61,25.4 15.24,26.04 15.24,30.67 C10.2 | U1.4 14.61,33.66 14.79,33.84 C1.2 | U7.2 16.83,20 17.27,19.55 R8.2
  other vias: 17.78,41.59 19.05,42.23 24.77,30.48 26.67,30.48 24.77,28.57 34.92,41.27 7.62,38.73 10.79,33.66 8.26,33.66 13.97,40 10.79,25.4 10.16,16.83 21.59,17.14 18.41,17.78 18.41,16.51 19.05,17.14 48.26,7.62 55.24,7.62 33.96,27.63 33.96,29.21 47.62,15.56 46.35,15.56 48.9,15.56 19.05,40.96 45.09,21.91 63.63,38.6 47.62,23.18 38.1,20.95 38.42,26.04 36.51,19.05 31.43,21.59 30.16,14.61 25.4,18.41 50.16,30.48 21.91,23.18 41.59,9.84 19.68,32.7 20.64,26.35
  pour Top (isolate 0.305, rank 6): -3.81,52.07 69.85,52.07 69.85,-2.54 -3.81,-2.54
  pour Bottom (isolate 0.305, rank 6): -3.81,52.07 69.85,52.07 69.85,-2.54 -3.81,-2.54
GPIO_PC1  (via drill 0.36)
  Top 0.203: U2.7 22.52,28.28 v22.23,28.57 | v32.38,35.88 54.29,35.88 v54.61,36.2
  Bottom 0.203: v22.23,28.57 22.23,32.38 22.54,32.7 23.18,32.7 24.13,33.66 24.13,34.92 24.45,35.24 31.75,35.24 v32.38,35.88 | J1.4 58.42,36.2 v54.61,36.2
HALL_PWM_SENSE  (via drill 0.36)
  Top 0.203: U2.24 29,31.28 29.23,31.51 33.1,31.51 33.38,31.79 56.76,31.79 59.52,29.03 59.52,23.27 60.25,22.54 J3.5 | v55.36,21.4 v55.36,16.87 | v49.92,3 49.92,1.91
  Top 0.406: U6.2 51.43,1.91 R17.1 | 49.92,1.91 U6.2 | U6.2 47.49,1.91 R16.2
  Bottom 0.203: J3.5 59.45,21.35 55.36,21.35 v55.36,21.4 | v55.36,16.87 55.36,13.35 53.44,11.43 53.44,1.19 53.37,1.12 49.92,1.12 v49.92,3
HALL_PWR_EN
  Top 0.203: U2.16 28.42,27.08 29.17,26.33 29.17,23.98 29.5,23.66 33.85,23.66 34.55,22.95 34.55,17.83 43.84,17.83 44.16,17.51 44.16,12.39 47.66,8.89 R18.1
I2C0_SCL  (via drill 0.36)
  Top 0.203: R2.2 19.91,35.65 20,35.56 v20,34.61 18.26,34.61 U1.6 | U2.9 23.88,26.99 v21.91,26.99 | J2.4 14.55,45.03 15.24,45.72 22.54,45.72 23.14,45.12 23.14,33.93 v22.86,33.66
  Bottom 0.203: 21.91,33.66 21.91,33.97 21.27,34.61 v20,34.61 | v22.86,33.66 21.91,33.66 | v21.91,26.99 21.91,27.99 21.59,28.31 21.59,28.84 21.87,29.12 21.87,32.53 21.91,32.57 21.91,33.66
I2C0_SDA  (via drill 0.36)
  Top 0.203: U1.5 v20.95,33.66 21.59,34.29 | 21.59,34.29 R1.2 | U2.8 21.12,27.78 v20.95,27.94 | 21.59,34.29 22.54,34.29 22.54,44.45 21.91,45.09 15.88,45.09 15.55,44.76 J2.3
  Bottom 0.203: v20.95,33.66 21.55,33.06 21.55,32.72 21.51,32.68 21.51,29.27 21.23,28.98 21.23,28.22 v20.95,27.94
MTR_CUR_LIMIT  (via drill 0.36)
  Top 0.203: v49.73,27.94 48.9,27.11 R9.1 | U2.12 25.47,24.06 v25.72,23.81 | v37.78,23.49 v37.78,27.62
  Bottom 0.203: J3.2 57.78,27.94 v49.73,27.94 38.1,27.94 v37.78,27.62 | v25.72,23.81 33.34,23.81 34.92,22.23 34.92,20 36.83,20 36.83,22.54 v37.78,23.49
MTR_EN
  Top 0.203: U2.22 29.01,30.28 29.53,30.8 35.35,30.8 35.83,30.31 35.83,23.27 36.25,22.86 R6.1
MTR_FAULT
  Top 0.203: C14.1 41.09,24.26 R6.2 41.29,22.66 U5.13
MTR_PHA  (via drill 0.36)
  Top 0.203: U2.23 29,30.78 29.38,31.15 33.38,31.15 33.66,31.43 36.63,31.43 37.11,30.95 v37.11,29.35 v37.11,24.55 | U5.1 43.88,20.07 v42.55,20.07
  Bottom 0.203: v42.55,20.07 42.55,24.55 v37.11,24.55 | J3.1 59.55,28.71 37.76,28.71 v37.11,29.35
MTR_PWMA  (via drill 0.36)
  Top 0.203: U2.25 32.3,31.98 32.7,32.38 56.8,32.38 58.56,30.63 61.76,30.63 62.4,29.99 62.4,25.83 61.65,25.08 J3.3 | U5.2 44.8,20.48 44.8,19.75 44.16,19.11 v43.52,19.11
  Bottom 0.203: v43.52,19.11 43.52,23.59 44.16,24.23 57.43,24.23 57.66,24 58.55,24 59.63,25.08 J3.3
N$1
  Top 0.203: U2.20 30,29.28 Y2.1 31.39,29.11 C8.1
N$2
  Top 0.406: U1.2 12.32,36.42 Y1.1 9.26,36.42 C5.1
N$3
  Top 0.203: U5.12 44.34,23.73 43.5,24.57 R15.1 R14.1
N$5
  Top 0.406: R19.1 52.32,7.37 Q1.3 51.16,8.66 R18.2
N$6
  Top 0.635: R20.1 10.79,22.01 Q3.3
N$7
  Top 0.203: Q2.2 43.83,47.3 44.77,46.35 BAT1.2
N$8
  Top 0.635: LED1.2 R4.2
N$9
  Top 0.635: LED2.2 R5.2
N$10
  Top 0.203: U4.3 20.31,19.04 19.68,18.41 19.68,16.51 19.05,15.88 16.51,15.88 15.88,16.51 R8.1
  Top 0.635: R8.1 14.47,17.78 R7.2
N$11
  Top 0.203: R14.2 40.51,27.12 C18.1
N$14
  Top 0.635: F1.2 9.48,20.02 Q3.2
N$15
  Top 0.635: F1.1 6.72,19.05 BAT2.1
N$16
  Top 0.203: U2.21 30,29.78 Y2.2 31.54,29.94 C9.1
N$17
  Top 0.406: U1.1 12.32,37.24 Y1.2 9.26,37.24 C6.1
N$19
  Top 0.203: U5.11 44.84,25.47 C15.1 R10.1 R9.2
N$20  (via drill 0.36)
  Top 0.203: U4.5 23.48,17.07 24.34,16.21 40.29,16.21 40.95,16.87 42.55,16.87 43.52,15.91 43.52,9.83 v43.84,9.51 | v52.48,5.35 53.02,4.8 C19.1
  Top 0.406: R17.2 53.02,1.72 C19.1
  Bottom 0.203: v43.84,9.51 52.16,9.51 52.48,9.19 v52.48,5.35
N$23
  Top 0.406: C16.2 49.04,6.48 Q1.1 51.18,5.33 51.62,4.89 C19.2 51.22,3.72 U6.3
OUTA1
  Top 0.305: U5.3 45.34,18.66
  Top 0.635: 45.34,18.66 45.09,18.41 45.09,12.7 47.31,10.47 57.15,10.47 57.15,6.35 57.78,5.71 63.5,5.71 63.83,6.04 J4.P$2
OUTA2
  Top 0.305: U5.5 49.96,21.16
  Top 0.635: 49.96,21.16 50.8,20.32 50.8,12.7 51.44,12.06 59.06,12.06 60.33,10.79 J4.P$1
RTCC_ALARM_INT  (via drill 0.36)
  Top 0.203: U2.32 23.81,32.13 23.81,37.97 23.77,38.01 23.77,39.14 23.5,39.42 23.5,39.95 23.81,40.27 23.81,40.64 v24.13,40.96 | v16.51,36.83 17.14,36.2 U1.7
  Bottom 0.203: v24.13,40.96 21.91,40.96 21.59,40.64 21.59,37.47 20.95,36.83 v16.51,36.83
SENSEA
  pour Top (isolate 0.203, rank 3, no thermals): 50.16,18.41 45.72,18.41 45.72,20.95 46.35,20.95 46.99,20.32 49.53,20.32 50.16,19.69
SPI0_MISO
  Top 0.203: U3.2 13.65,27.94 13.65,31.43 13.93,31.71 18.1,31.71 18.41,31.39 18.41,30.48 18.73,30.16 20.5,30.16 20.61,30.28 U2.3
SPI0_MOSI  (via drill 0.36)
  Top 0.203: U3.5 v19.37,25.4 | v19.37,30.8 23.25,30.8 U2.2
  Bottom 0.203: v19.37,30.8 19.05,30.48 19.05,25.72 v19.37,25.4
SPI0_SCK
  Top 0.203: U3.6 19.68,26.67 19.68,28.89 20.57,29.78 U2.4
UART_RX  (via drill 0.36)
  Top 0.203: U2.31 24.47,32.73 24.17,33.02 24.17,38.12 24.13,38.15 v24.13,39.69
  Bottom 0.203: J1.3 57.78,42.23 54.93,39.37 24.45,39.37 v24.13,39.69
UART_TX  (via drill 0.36)
  Top 0.203: U2.30 24.97,32.73 24.68,33.02 24.68,38.33 v24.77,38.42
  Bottom 0.203: v24.77,38.42 56.52,38.42 57.81,39.71 59.35,39.71 J1.2
UPDI  (via drill 0.36)
  Top 0.203: U2.27 26.47,33.13 v26.67,33.34
  Bottom 0.203: v26.67,33.34 56.2,33.34 57.47,34.61 J1.5
V_BAT  (via drill 0.36)
  Top 0.635: v54.4,29.99 54.4,22.73 C13.1
  Bottom 0.635: v14.39,21.03 14.39,15.59 16.31,13.68 45.11,13.68 45.44,13.35 51.84,13.35 53.12,14.63 v53.12,15.27 | J1.1 60.1,44.77 61.12,43.75 61.12,30.31 60.8,29.99 v54.4,29.99
  other vias: 14.39,21.99 13.43,21.99 12.79,19.75 12.79,16.87 53.76,14.31 52.48,16.23 52.48,14.31 53.76,16.23
  pour Top (isolate 0.305, no thermals): 12.06,22.86 11.86,16.01 13.65,16.01 13.65,18.41 17.14,18.41 17.14,21.59 15.24,21.59 15.24,22.86
  pour Top (isolate 0.203, no thermals): 54.4,23.91 54.4,13.67 51.52,13.67 51.52,21.35 46.08,21.35 46.08,21.99 48.96,21.99 48.96,23.91
  pour Bottom: 51.52,17.19 54.4,17.19 54.4,13.67 51.52,13.67
VCC  (via drill 0.36)
  Top 0.305: U4.8 23.48,21.76 C11.2 | U2.28 25.97,34.22 C3.1 C2.1 29.21,34.29 R3.1 | v42.23,15.59 42.88,14.95 42.88,5.03 47.26,5.03 C16.1 | v33.66,26.04 L1.1 | v35.88,20.95 37.15,19.69 R13.1
  Top 0.406: U3.8 16.51,30.66 C10.1 16.51,24.13 17.14,23.49 v18.41,23.49 | C1.1 16.19,38.42 | 16.19,38.42 17.14,37.47 U1.8 19.68,37.47 R2.1 R1.1 | U6.1 49.12,4.22 48.26,5.08 C16.1 R16.1 | v19.68,23.49 20.32,24.13 22.54,24.13 23.62,23.05 C11.2 | v16.51,33.97 16.51,34.29 16.19,34.61 16.19,36.11 15.77,36.52 15.77,37.13 16.19,37.55 16.19,38.42 | R5.1 57.15,16.68 v57.28,16.55 57.15,16.42 R4.1 | R3.1 v29.84,36.2
  Top 0.635: J2.2 16.55,41.95 15.88,41.27 v15.24,41.27
  Bottom 0.305: v42.23,15.59 20.47,15.59 19.83,16.23 19.83,20.81 v19.68,20.95 21.51,20.95 22.71,19.75 22.71,16.55 23.11,16.16 40.56,16.16 40.95,16.55 48.32,16.55 50.24,18.47 | 50.24,18.47 | 50.24,18.47 55.04,18.47 56.96,16.55 | v33.66,26.04 33.34,26.35 22.54,26.35 v19.68,23.49 21.64,25.45 26.95,25.45 27.96,24.45 33.97,24.45 35.88,22.54 v35.88,20.95
  Bottom 0.406: v16.51,33.97 17.14,33.34 17.14,24.77 v18.41,23.49 18.41,35.56 19.05,36.2 v29.84,36.2 | 56.96,16.55 v57.28,16.55
  Bottom 0.635: v15.24,41.27 15.24,25.08 16.83,23.49 v18.41,23.49
  other vias: 19.05,21.91 19.05,22.86
  pour Top (isolate 0.406, rank 2, no thermals): 20.32,19.69 17.78,19.69 17.78,24.13 20.32,24.13
  pour Bottom (isolate 0.406, rank 2, no thermals): 20.32,19.69 17.78,19.69 17.78,24.13 20.32,24.13

### Text on the board
tNames: US Biologic / LymeShield System MotorBoard-G2R0.1
bNames: VCC / TXD / RXD / GPIO / OPDI / GND | !RST | LIMIT / FAULT / GND | PHA / PWM / HAL | ERR | STAT | US Biologic / LymeShield System / MotorBoard / Gen2 R0.1